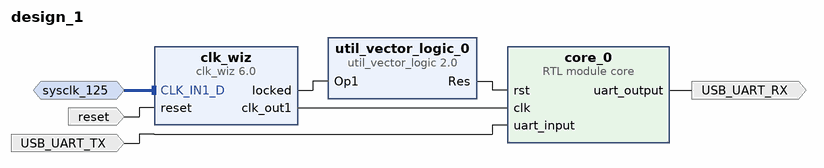
[diagram p0: block diagram of the top level]
# Vivado block design design_1, xcku040-ffva1156-2-e, Vivado 2019.2.1
create_bd_design design_1

create_bd_intf_port -mode Slave -vlnv xilinx.com:interface:diff_clock_rtl:1.0 sysclk_125
set_property -dict {CONFIG.FREQ_HZ 125000000} [get_bd_intf_ports sysclk_125]
create_bd_port -dir I -type rst reset
set_property -dict {CONFIG.POLARITY ACTIVE_HIGH} [get_bd_ports reset]
create_bd_port -dir I -type data USB_UART_TX
create_bd_port -dir O -type data USB_UART_RX

create_bd_cell -type ip -vlnv xilinx.com:ip:clk_wiz:6.0 clk_wiz
set_property -dict [list \
  CONFIG.CLKOUT1_JITTER 211.127 \
  CONFIG.CLKOUT1_PHASE_ERROR 240.487 \
  CONFIG.CLKOUT1_REQUESTED_OUT_FREQ 130 \
  CONFIG.CLK_IN1_BOARD_INTERFACE sysclk_125 \
  CONFIG.MMCM_CLKFBOUT_MULT_F 39.000 \
  CONFIG.MMCM_CLKOUT0_DIVIDE_F 7.500 \
  CONFIG.MMCM_DIVCLK_DIVIDE 5 \
  CONFIG.RESET_BOARD_INTERFACE reset \
  CONFIG.USE_BOARD_FLOW true \
] [get_bd_cells clk_wiz]
create_bd_cell -type ip -vlnv xilinx.com:ip:util_vector_logic:2.0 util_vector_logic_0
set_property -dict {CONFIG.C_OPERATION not CONFIG.C_SIZE 1} [get_bd_cells util_vector_logic_0]
create_bd_cell -type module -reference core core_0

# ---- connections ----

connect_bd_intf_net -intf_net sysclk_125_1 [get_bd_intf_ports sysclk_125] [get_bd_intf_pins clk_wiz/CLK_IN1_D]
connect_bd_net [get_bd_pins clk_wiz/clk_out1] [get_bd_pins core_0/clk]
connect_bd_net [get_bd_pins clk_wiz/locked] [get_bd_pins util_vector_logic_0/Op1]
connect_bd_net [get_bd_pins util_vector_logic_0/Res] [get_bd_pins core_0/rst]
connect_bd_net [get_bd_ports reset] [get_bd_pins clk_wiz/reset]
connect_bd_net [get_bd_ports USB_UART_TX] [get_bd_pins core_0/uart_input]
connect_bd_net [get_bd_pins core_0/uart_output] [get_bd_ports USB_UART_RX]

validate_bd_design
save_bd_design
